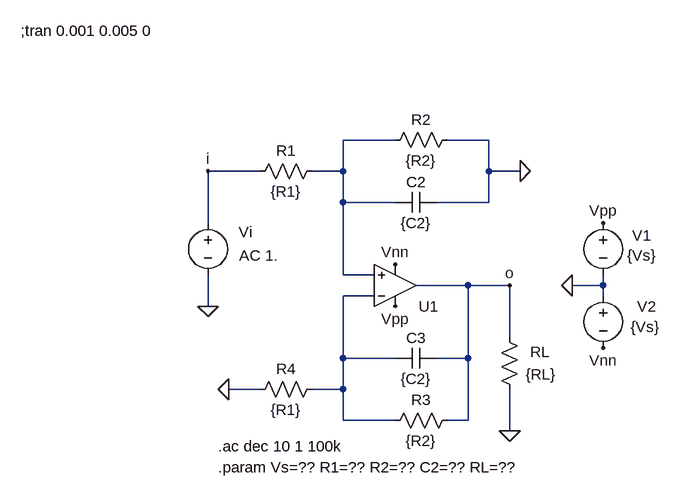
[diagram p0: schematic Filter04Fig.asc]
Filter04Fig.asc, the LTspice schematic file:
Version 4
SHEET 1 968 680
WIRE 144 0 64 0
WIRE 288 0 224 0
WIRE -64 48 -144 48
WIRE 64 48 64 0
WIRE 64 48 16 48
WIRE 288 48 288 0
WIRE 336 48 288 48
WIRE 64 96 64 48
WIRE 144 96 64 96
WIRE 288 96 288 48
WIRE 288 96 208 96
WIRE -144 128 -144 48
WIRE 64 208 64 96
WIRE 112 208 64 208
WIRE 256 224 176 224
WIRE 320 224 256 224
WIRE 464 224 464 208
WIRE 464 224 416 224
WIRE 112 240 64 240
WIRE 464 240 464 224
WIRE -144 256 -144 208
WIRE 320 304 320 224
WIRE 64 336 64 240
WIRE 144 336 64 336
WIRE 256 336 256 224
WIRE 256 336 208 336
WIRE -64 384 -112 384
WIRE 64 384 64 336
WIRE 64 384 16 384
WIRE 64 432 64 384
WIRE 144 432 64 432
WIRE 256 432 256 336
WIRE 256 432 224 432
WIRE 320 448 320 384
FLAG 464 128 Vpp
FLAG 416 224 0
FLAG 464 320 Vnn
FLAG 320 448 0
FLAG -144 256 0
FLAG 144 256 Vpp
FLAG 144 192 Vnn
FLAG 320 224 o
FLAG -144 48 i
FLAG 336 48 0
FLAG -112 384 0
SYMBOL voltage 464 112 R0
WINDOW 123 0 0 Left 0
WINDOW 39 0 0 Left 0
WINDOW 0 45 35 Left 2
WINDOW 3 37 66 Left 2
SYMATTR InstName V1
SYMATTR Value {Vs}
SYMBOL voltage 464 224 R0
WINDOW 123 0 0 Left 0
WINDOW 39 0 0 Left 0
WINDOW 0 52 32 Left 2
WINDOW 3 42 64 Left 2
SYMATTR InstName V2
SYMATTR Value {Vs}
SYMBOL res 304 288 R0
WINDOW 0 48 38 Left 2
WINDOW 3 41 73 Left 2
SYMATTR InstName RL
SYMATTR Value {RL}
SYMBOL voltage -144 112 R0
WINDOW 3 48 66 Left 2
WINDOW 123 0 0 Left 0
WINDOW 39 0 0 Left 0
WINDOW 0 47 30 Left 2
SYMATTR Value AC 1.
SYMATTR InstName Vi
SYMBOL Opamps\\UniversalOpamp2 144 224 M180
WINDOW 0 36 -32 Left 2
SYMATTR InstName U1
SYMBOL cap 208 80 R90
WINDOW 0 0 32 VBottom 2
WINDOW 3 32 32 VTop 2
SYMATTR InstName C2
SYMATTR Value {C2}
SYMBOL res 32 32 R90
WINDOW 0 0 56 VBottom 2
WINDOW 3 32 56 VTop 2
SYMATTR InstName R1
SYMATTR Value {R1}
SYMBOL res 240 -16 R90
WINDOW 0 0 56 VBottom 2
WINDOW 3 32 56 VTop 2
SYMATTR InstName R2
SYMATTR Value {R2}
SYMBOL res 128 448 R270
WINDOW 0 32 56 VTop 2
WINDOW 3 0 56 VBottom 2
SYMATTR InstName R3
SYMATTR Value {R2}
SYMBOL cap 144 352 R270
WINDOW 0 32 32 VTop 2
WINDOW 3 0 32 VBottom 2
SYMATTR InstName C3
SYMATTR Value {C2}
SYMBOL res -80 400 R270
WINDOW 0 32 56 VTop 2
WINDOW 3 0 56 VBottom 2
SYMATTR InstName R4
SYMATTR Value {R1}
TEXT -128 504 Left 2 !.param Vs=?? R1=?? R2=?? C2=?? RL=??
TEXT -432 -168 Left 2 !;tran 0.001 0.005 0
TEXT -128 472 Left 2 !.ac dec 10 1 100k

The netlist it stands for:
* Filter04Fig.asc
V1 Vpp 0 {Vs}
V2 0 Vnn {Vs}
RL o 0 {RL}
Vi i 0 AC 1.
XU1 N001 N002 Vpp Vnn o level.2 Avol=1Meg GBW=10Meg Slew=10Meg ilimit=25m rail=0 Vos=0 phimargin=45 en=0 enk=0 in=0 ink=0 Rin=500Meg  ; pins IN+ IN- V+ V- OUT
C2 0 N001 {C2}
R1 N001 i {R1}
R2 0 N001 {R2}
R3 N002 o {R2}
C3 N002 o {C2}
R4 0 N002 {R1}
.param Vs=?? R1=?? R2=?? C2=?? RL=??
;tran 0.001 0.005 0
.ac dec 10 1 100k
.lib UniversalOpamps2.sub
.backanno
.end